# Altium schematic sheet communition.SchDoc
size A4; DocumentNumber: 4; Revision: V1.0; SheetNumber: 4; SheetTotal: 9
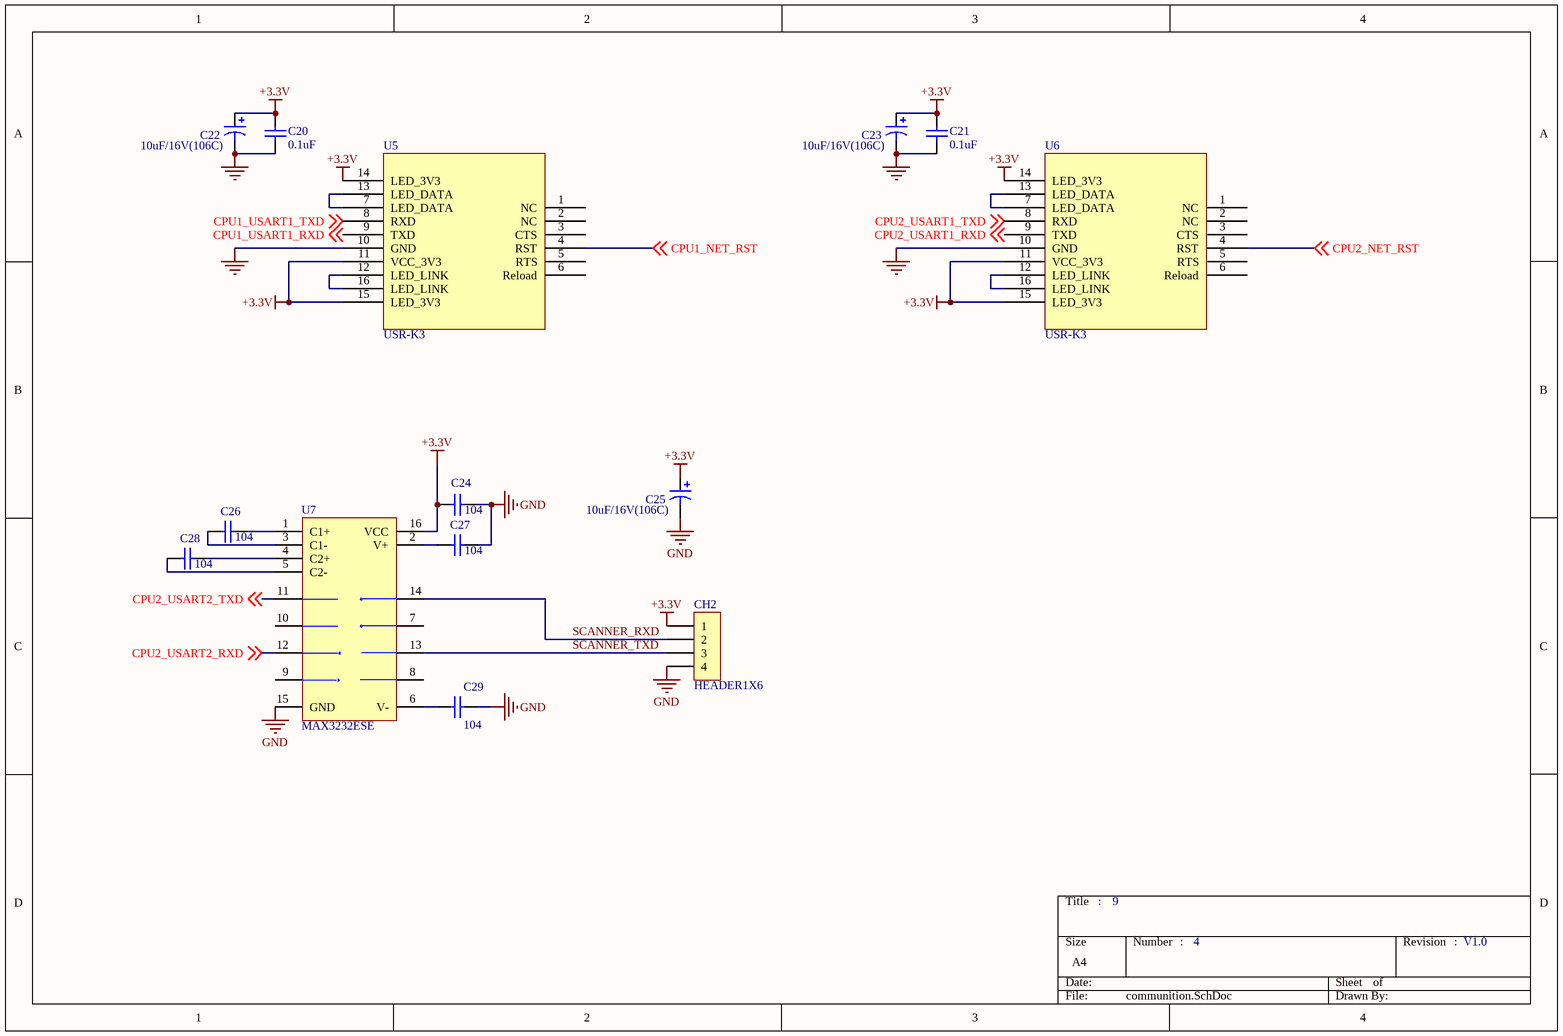
[diagram p0: communition.SchDoc]

## Parts
C20  value 0.1uF  [0805]  (hidden comment: Cap)
C21  value 0.1uF  [0805]  (hidden comment: Cap)
C22  value 10uF/16V(106C)  [CAP A-3216]  (hidden comment: Cap Pol3)
C23  value 10uF/16V(106C)  [CAP A-3216]  (hidden comment: Cap Pol3)
C24  value 104  [0805]  (hidden comment: Cap)
C25  value 10uF/16V(106C)  [CAP A-3216]  (hidden comment: Cap Pol3)
C26  value 104  [0805]  (hidden comment: Cap)
C27  value 104  [0805]  (hidden comment: Cap)
C28  value 104  [0805]  (hidden comment: Cap)
C29  value 104  [0805]  (hidden comment: Cap)
CH2  HEADER1X6  [CH3.96-4PIN]
U5  USR-K3  [USR-K3]
U6  USR-K3  [USR-K3]
U7  MAX3232ESE  [NSO16_N]

## Nets
+3.3V: C20.2 C21.2 C22.1 C23.1 C24.2 C25.1 CH2.1 U5.11(VCC_3V3) U5.14(LED_3V3) U5.15(LED_3V3) U6.11(VCC_3V3) U6.14(LED_3V3) U6.15(LED_3V3) U7.16(VCC)
GND: C20.1 C21.1 C22.2 C23.2 C24.1 C25.2 C27.1 C29.1 CH2.4 U5.10(GND) U6.10(GND) U7.15(GND)
CPU1_NET_RST: U5.4(RST) ; off-sheet CPU1_NET_RST
CPU1_USART1_RXD: U5.9(TXD) ; off-sheet CPU1_USART1_RXD
CPU1_USART1_TXD: U5.8(RXD) ; off-sheet CPU1_USART1_TXD
CPU2_NET_RST: U6.4(RST) ; off-sheet CPU2_NET_RST
CPU2_USART1_RXD: U6.9(TXD) ; off-sheet CPU2_USART1_RXD
CPU2_USART1_TXD: U6.8(RXD) ; off-sheet CPU2_USART1_TXD
CPU2_USART2_RXD: U7.12(R1OUT) ; off-sheet CPU2_USART2_RXD
CPU2_USART2_TXD: U7.11(T1IN) ; off-sheet CPU2_USART2_TXD
SCANNER_RXD: CH2.2 U7.14(T1OUT)
SCANNER_TXD: CH2.3 U7.13(R1IN)
NetC26_1: C26.1 U7.1(C1+)
NetC26_2: C26.2 U7.3(C1-)
NetC27_2: C27.2 U7.2(V+)
NetC28_1: C28.1 U7.5(C2-)
NetC28_2: C28.2 U7.4(C2+)
NetC29_2: C29.2 U7.6(V-)
NetU5_7: U5.7(LED_DATA) U5.13(LED_DATA)
NetU5_12: U5.12(LED_LINK) U5.16(LED_LINK)
NetU6_7: U6.7(LED_DATA) U6.13(LED_DATA)
NetU6_12: U6.12(LED_LINK) U6.16(LED_LINK)

Not connected (* = marked no-connect by the designer): U5 1(NC) 2(NC) 3(CTS) 5(RTS) 6(Reload); U6 1(NC) 2(NC) 3(CTS) 5(RTS) 6(Reload); U7 7(T2OUT) 8(R2IN) 9(R2OUT) 10(T2IN)

## Notes on the sheet
- :

## Library data of the parts
C20 C21 C24 C26-C29 = Cap: Capacitor; Published: 8-Jun-2000; LatestRevisionDate: 17-Jul-2002; LatestRevisionNote: Re-released for DXP Platform.; PackageReference: RAD-0.3; Publisher: Altium Limited
C22 C23 C25 = Cap Pol3: Polarized Capacitor (Surface Mount); Published: 8-Jun-2000; LatestRevisionDate: 17-Jul-2002; LatestRevisionNote: Re-released for DXP Platform.; PackageReference: C0805; Publisher: Altium Limited
CH2 = HEADER1X4